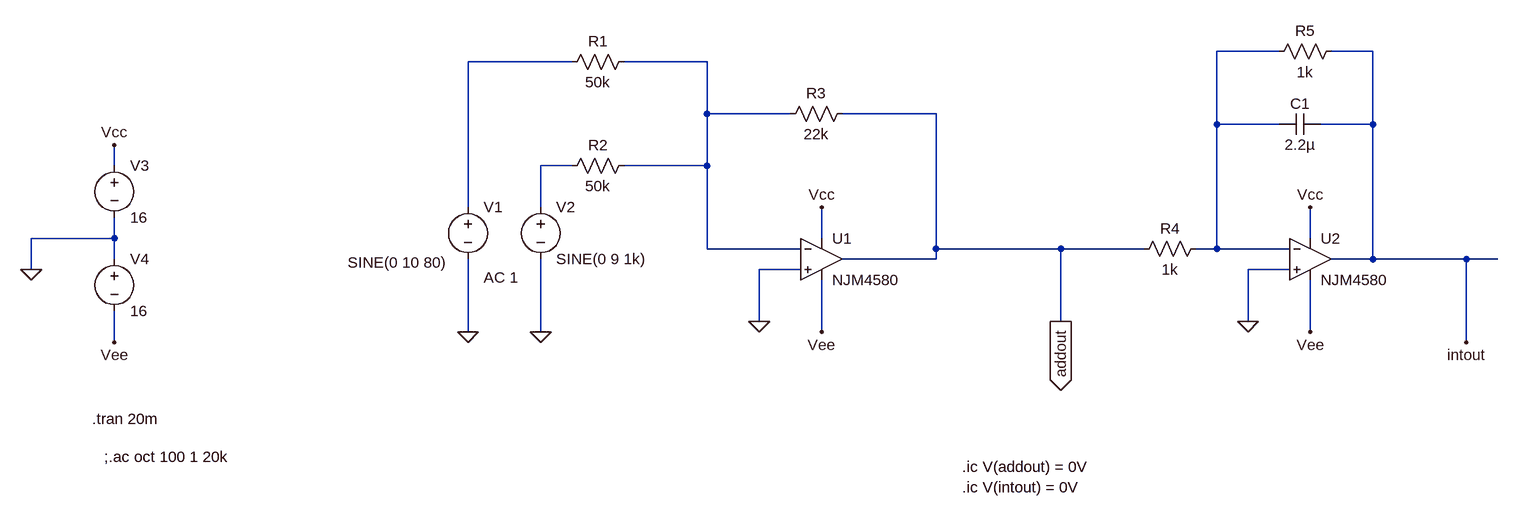
[diagram p0: schematic subwoofer_mix_poweramp.asc]
subwoofer_mix_poweramp.asc, the LTspice schematic file:
Version 4
SHEET 1 1124 680
WIRE 784 -160 688 -160
WIRE 928 -160 864 -160
WIRE -304 -144 -464 -144
WIRE -96 -144 -224 -144
WIRE -96 -64 -96 -144
WIRE 32 -64 -96 -64
WIRE 256 -64 112 -64
WIRE 688 -48 688 -160
WIRE 784 -48 688 -48
WIRE 928 -48 928 -160
WIRE 928 -48 848 -48
WIRE -1008 16 -1008 -16
WIRE -304 16 -352 16
WIRE -96 16 -96 -64
WIRE -96 16 -224 16
WIRE -464 80 -464 -144
WIRE -352 80 -352 16
WIRE -1008 128 -1008 96
WIRE -1008 128 -1136 128
WIRE 80 128 80 80
WIRE 832 128 832 80
WIRE -96 144 -96 16
WIRE 48 144 -96 144
WIRE 256 144 256 -64
WIRE 448 144 256 144
WIRE 576 144 448 144
WIRE 688 144 688 -48
WIRE 688 144 656 144
WIRE 800 144 688 144
WIRE -1008 160 -1008 128
WIRE 256 160 256 144
WIRE 256 160 112 160
WIRE 928 160 928 -48
WIRE 928 160 864 160
WIRE 1072 160 928 160
WIRE 1120 160 1072 160
WIRE -1136 176 -1136 128
WIRE 48 176 -16 176
WIRE 800 176 736 176
WIRE -16 256 -16 176
WIRE 448 256 448 144
WIRE 736 256 736 176
WIRE -464 272 -464 160
WIRE -352 272 -352 160
WIRE 80 272 80 192
WIRE 832 272 832 192
WIRE -1008 288 -1008 240
WIRE 1072 288 1072 160
FLAG -1008 -16 Vcc
FLAG 80 80 Vcc
FLAG 832 80 Vcc
FLAG -1008 288 Vee
FLAG 80 272 Vee
FLAG 832 272 Vee
FLAG -464 272 0
FLAG -352 272 0
FLAG -16 256 0
FLAG 736 256 0
FLAG 448 256 addout
IOPIN 448 256 Out
FLAG 1072 288 intout
FLAG -1136 176 0
SYMBOL Opamps\\NJM4580 80 96 R0
SYMATTR InstName U1
SYMBOL Opamps\\NJM4580 832 96 R0
SYMATTR InstName U2
SYMBOL res -208 -160 R90
WINDOW 0 0 56 VBottom 2
WINDOW 3 32 56 VTop 2
SYMATTR InstName R1
SYMATTR Value 50k
SYMBOL res -208 0 R90
WINDOW 0 0 56 VBottom 2
WINDOW 3 32 56 VTop 2
SYMATTR InstName R2
SYMATTR Value 50k
SYMBOL res 128 -80 R90
WINDOW 0 0 56 VBottom 2
WINDOW 3 32 56 VTop 2
SYMATTR InstName R3
SYMATTR Value 22k
SYMBOL voltage -464 64 R0
WINDOW 3 -185 101 Left 2
WINDOW 123 24 124 Left 2
WINDOW 39 0 0 Left 0
SYMATTR InstName V1
SYMATTR Value SINE(0 10 80)
SYMATTR Value2 AC 1
SYMBOL voltage -352 64 R0
WINDOW 123 0 0 Left 0
WINDOW 39 0 0 Left 0
SYMATTR InstName V2
SYMATTR Value SINE(0 9 1k)
SYMBOL res 672 128 R90
WINDOW 0 0 56 VBottom 2
WINDOW 3 32 56 VTop 2
SYMATTR InstName R4
SYMATTR Value 1k
SYMBOL res 880 -176 R90
WINDOW 0 0 56 VBottom 2
WINDOW 3 32 56 VTop 2
SYMATTR InstName R5
SYMATTR Value 1k
SYMBOL cap 848 -64 R90
WINDOW 0 0 32 VBottom 2
WINDOW 3 32 32 VTop 2
SYMATTR InstName C1
SYMATTR Value 2.2µ
SYMBOL voltage -1008 0 R0
WINDOW 123 0 0 Left 0
WINDOW 39 0 0 Left 0
SYMATTR InstName V3
SYMATTR Value 16
SYMBOL voltage -1008 144 R0
WINDOW 123 0 0 Left 0
WINDOW 39 0 0 Left 0
SYMATTR InstName V4
SYMATTR Value 16
TEXT -1042 406 Left 2 !.tran 20m
TEXT 296 480 Left 2 !.ic V(addout) = 0V\n.ic V(intout) = 0V
TEXT -1024 464 Left 2 !;.ac oct 100 1 20k

The netlist it stands for:
* subwoofer_mix_poweramp.asc
XU1 0 N003 Vcc Vee addout NJM4580  ; pins In+ In- V+ V- OUT
XU2 0 N001 Vcc Vee intout NJM4580  ; pins In+ In- V+ V- OUT
R1 N003 N002 50k
R2 N003 N004 50k
R3 addout N003 22k
V1 N002 0 SINE(0 10 80) AC 1
V2 N004 0 SINE(0 9 1k)
R4 N001 addout 1k
R5 intout N001 1k
C1 intout N001 2.2µ
V3 Vcc 0 16
V4 0 Vee 16
.tran 20m
.ic V(addout) = 0V
.ic V(intout) = 0V
;.ac oct 100 1 20k
.backanno
.end